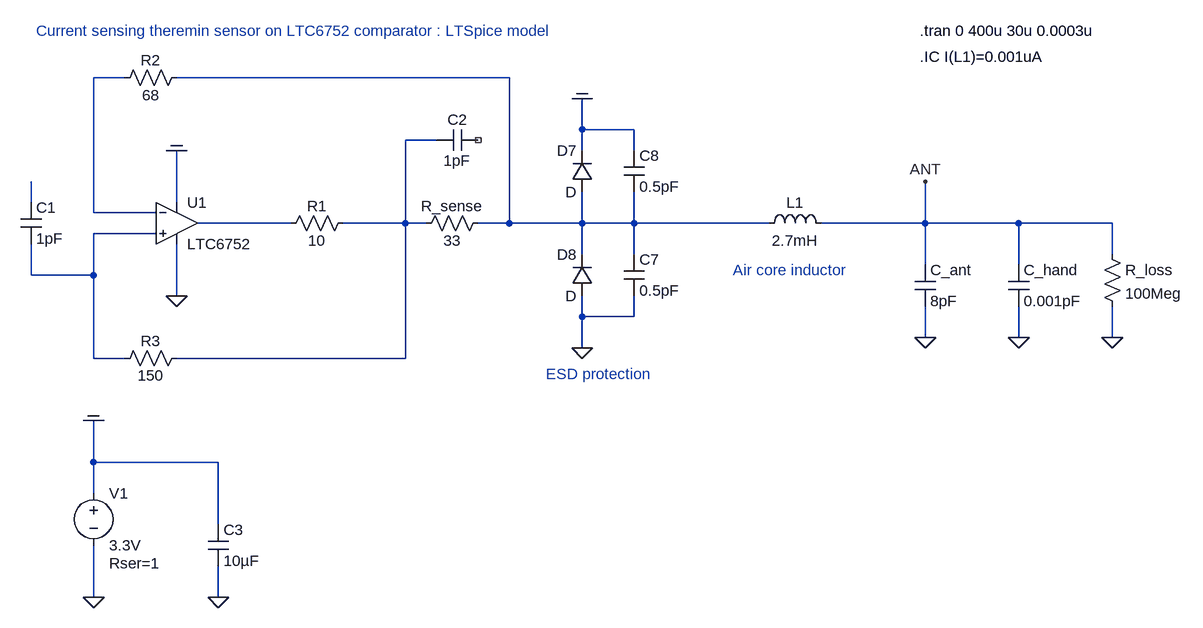
[diagram p0: schematic 2021_comparator_ltc6752_current_sensing_01.asc]
2021_comparator_ltc6752_current_sensing_01.asc, the LTspice schematic file:
Version 4
SHEET 1 4260 2564
WIRE 384 80 336 80
WIRE 976 80 464 80
WIRE 1088 160 1088 112
WIRE 1168 160 1088 160
WIRE 864 176 816 176
WIRE 1088 192 1088 160
WIRE 1168 192 1168 160
WIRE 240 272 240 240
WIRE 464 272 464 192
WIRE 336 288 336 80
WIRE 432 288 336 288
WIRE 640 304 496 304
WIRE 816 304 816 176
WIRE 816 304 720 304
WIRE 848 304 816 304
WIRE 976 304 976 80
WIRE 976 304 928 304
WIRE 1088 304 1088 256
WIRE 1088 304 976 304
WIRE 1168 304 1168 256
WIRE 1168 304 1088 304
WIRE 1376 304 1168 304
WIRE 1616 304 1616 240
WIRE 1616 304 1456 304
WIRE 1760 304 1616 304
WIRE 1904 304 1760 304
WIRE 432 320 336 320
WIRE 1088 352 1088 304
WIRE 1168 352 1168 304
WIRE 1904 352 1904 304
WIRE 1616 368 1616 304
WIRE 1760 368 1760 304
WIRE 240 384 240 336
WIRE 336 384 336 320
WIRE 336 384 240 384
WIRE 464 416 464 336
WIRE 1088 448 1088 416
WIRE 1168 448 1168 416
WIRE 1168 448 1088 448
WIRE 1616 480 1616 432
WIRE 1760 480 1760 432
WIRE 1904 480 1904 432
WIRE 1088 496 1088 448
WIRE 336 512 336 384
WIRE 384 512 336 512
WIRE 816 512 816 304
WIRE 816 512 464 512
WIRE 336 672 336 608
WIRE 528 672 336 672
WIRE 336 720 336 672
WIRE 528 768 528 672
WIRE 336 880 336 800
WIRE 528 880 528 832
FLAG 336 880 0
FLAG 336 608 COM
FLAG 464 192 COM
FLAG 464 416 0
FLAG 1616 480 0
FLAG 1616 240 ANT
FLAG 1088 112 COM
FLAG 1088 496 0
FLAG 1760 480 0
FLAG 1904 480 0
FLAG 528 880 0
SYMBOL voltage 336 704 R0
WINDOW 123 0 0 Left 0
WINDOW 39 24 124 Left 2
SYMATTR SpiceLine Rser=1
SYMATTR InstName V1
SYMATTR Value 3.3V
SYMBOL Comparators\\LTC6752 464 240 R0
SYMATTR InstName U1
SYMBOL ind 1360 320 R270
WINDOW 0 32 56 VTop 2
WINDOW 3 5 56 VBottom 2
SYMATTR InstName L1
SYMATTR Value 2.7mH
SYMATTR SpiceLine Ipk=0.5 Rser=120 Cpar=1.1pF
SYMBOL cap 1600 368 R0
SYMATTR InstName C_ant
SYMATTR Value 8pF
SYMBOL diode 1104 256 R180
WINDOW 0 24 64 Left 2
WINDOW 3 24 0 Left 2
SYMATTR InstName D7
SYMBOL diode 1104 416 R180
WINDOW 0 24 64 Left 2
WINDOW 3 24 0 Left 2
SYMATTR InstName D8
SYMBOL cap 1152 352 R0
SYMATTR InstName C7
SYMATTR Value 0.5pF
SYMBOL cap 1152 192 R0
SYMATTR InstName C8
SYMATTR Value 0.5pF
SYMBOL res 944 288 R90
WINDOW 0 5 56 VBottom 2
WINDOW 3 27 56 VTop 2
SYMATTR InstName R_sense
SYMATTR Value 33
SYMBOL res 480 64 R90
WINDOW 0 5 56 VBottom 2
WINDOW 3 27 56 VTop 2
SYMATTR InstName R2
SYMATTR Value 68
SYMBOL res 480 496 R90
WINDOW 0 5 56 VBottom 2
WINDOW 3 27 56 VTop 2
SYMATTR InstName R3
SYMATTR Value 150
SYMBOL cap 224 272 R0
SYMATTR InstName C1
SYMATTR Value 1pF
SYMBOL res 736 288 R90
WINDOW 0 5 56 VBottom 2
WINDOW 3 27 56 VTop 2
SYMATTR InstName R1
SYMATTR Value 10
SYMBOL cap 1744 368 R0
SYMATTR InstName C_hand
SYMATTR Value 0.001pF
SYMBOL res 1888 336 R0
WINDOW 0 36 40 Left 2
WINDOW 3 36 76 Left 2
SYMATTR InstName R_loss
SYMATTR Value 100Meg
SYMBOL cap 928 160 R90
WINDOW 0 0 32 VBottom 2
WINDOW 3 32 32 VTop 2
SYMATTR InstName C2
SYMATTR Value 1pF
SYMBOL cap 512 768 R0
SYMATTR InstName C3
SYMATTR Value 10µF
TEXT 1608 8 Left 2 !.tran 0 400u 30u 0.0003u
TEXT 1608 48 Left 2 !.IC I(L1)=0.001uA
TEXT 1032 536 Left 2 ;ESD protection
TEXT 1320 376 Left 2 ;Air core inductor
TEXT 248 8 Left 2 ;Current sensing theremin sensor on LTC6752 comparator : LTSpice model

The netlist it stands for:
* 2021_comparator_ltc6752_current_sensing_01.asc
V1 COM 0 3.3V Rser=1
XU1 N006 N001 COM 0 N005 LTC6752  ; pins In+ In- V+ V- OUT
L1 N002 ANT 2.7mH Ipk=0.5 Rser=120 Cpar=1.1pF
C_ant ANT 0 8pF
D7 N002 COM D
D8 0 N002 D
C7 N002 0 0.5pF
C8 COM N002 0.5pF
R_sense N002 N003 33
R2 N002 N001 68
R3 N003 N006 150
C1 N004 N006 1pF
R1 N003 N005 10
C_hand ANT 0 0.001pF
R_loss ANT 0 100Meg
C2 NC_01 N003 1pF
C3 COM 0 10µF
.model D D
.lib standard.dio
.tran 0 400u 30u 0.0003u
.IC I(L1)=0.001uA
* ESD protection
* Air core inductor
* Current sensing theremin sensor on LTC6752 comparator : LTSpice model
.lib LTC7.lib
.backanno
.end